# Altium schematic sheet 2) LPC1850_ P5-PA.SchDoc
size 420 x 297 mm
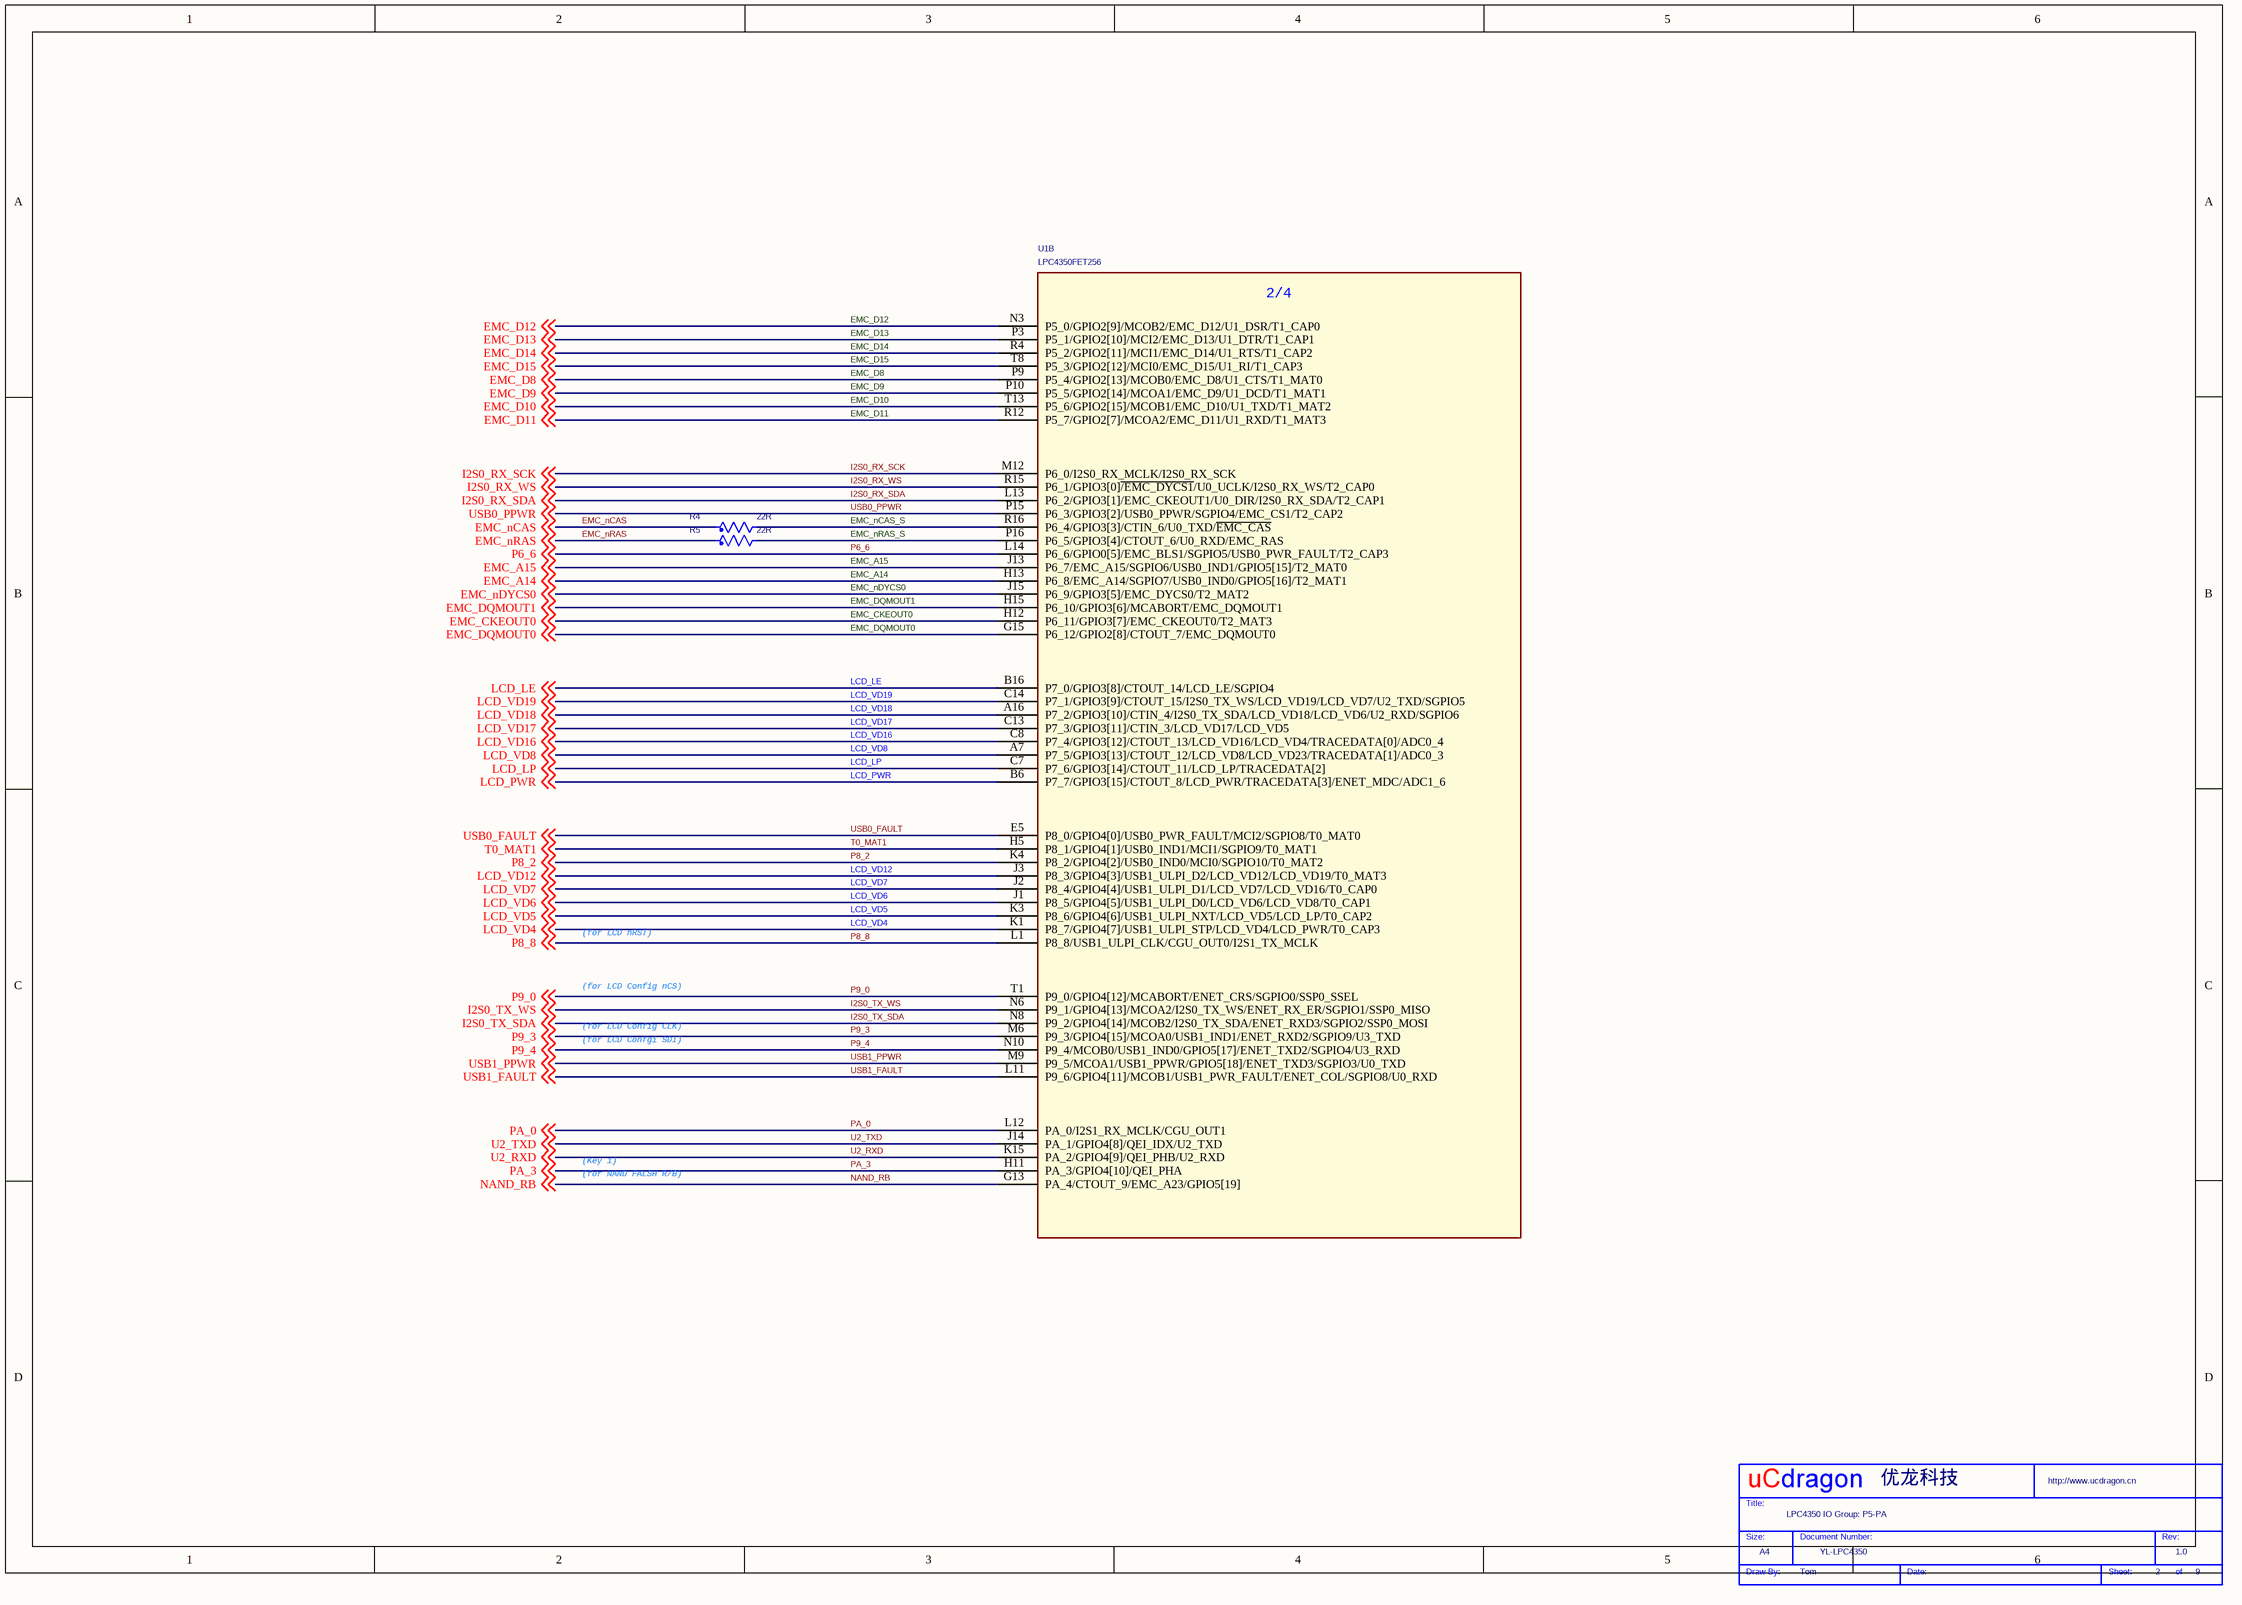
[diagram p0: 2) LPC1850_ P5-PA.SchDoc]

## Parts
*  Company: 优龙科技  Drawing: Tom  Doc: YL-LPC4350  RevCode: 1.0  Title: LPC4350 IO Group: P5-PA  Page Size: A4  Page Number: 2  Page Count: 9  (hidden comment: My Title 0)  (graphical)
R4  22R  [R0603]
R5  22R  [R0603]
U1  LPC4350FET256  [LBGA256]  (part B of 4)

## Nets
EMC_A14: U1.H13(P6_8/EMC_A14/SGPIO7/USB0_IND0/GPIO5[16]/T2_MAT1) ; off-sheet EMC_A14
EMC_A15: U1.J13(P6_7/EMC_A15/SGPIO6/USB0_IND1/GPIO5[15]/T2_MAT0) ; off-sheet EMC_A15
EMC_CKEOUT0: U1.H12(P6_11/GPIO3[7]/EMC_CKEOUT0/T2_MAT3) ; off-sheet EMC_CKEOUT0
EMC_D8: U1.P9(P5_4/GPIO2[13]/MCOB0/EMC_D8/U1_CTS/T1_MAT0) ; off-sheet EMC_D8
EMC_D9: U1.P10(P5_5/GPIO2[14]/MCOA1/EMC_D9/U1_DCD/T1_MAT1) ; off-sheet EMC_D9
EMC_D10: U1.T13(P5_6/GPIO2[15]/MCOB1/EMC_D10/U1_TXD/T1_MAT2) ; off-sheet EMC_D10
EMC_D11: U1.R12(P5_7/GPIO2[7]/MCOA2/EMC_D11/U1_RXD/T1_MAT3) ; off-sheet EMC_D11
EMC_D12: U1.N3(P5_0/GPIO2[9]/MCOB2/EMC_D12/U1_DSR/T1_CAP0) ; off-sheet EMC_D12
EMC_D13: U1.P3(P5_1/GPIO2[10]/MCI2/EMC_D13/U1_DTR/T1_CAP1) ; off-sheet EMC_D13
EMC_D14: U1.R4(P5_2/GPIO2[11]/MCI1/EMC_D14/U1_RTS/T1_CAP2) ; off-sheet EMC_D14
EMC_D15: U1.T8(P5_3/GPIO2[12]/MCI0/EMC_D15/U1_RI/T1_CAP3) ; off-sheet EMC_D15
EMC_DQMOUT0: U1.G15(P6_12/GPIO2[8]/CTOUT_7/EMC_DQMOUT0) ; off-sheet EMC_DQMOUT0
EMC_DQMOUT1: U1.H15(P6_10/GPIO3[6]/MCABORT/EMC_DQMOUT1) ; off-sheet EMC_DQMOUT1
EMC_nCAS: R4.1 ; off-sheet EMC_nCAS
EMC_nCAS_S: R4.2 U1.R16(P6_4/GPIO3[3]/CTIN_6/U0_TXD/~{EMC_CAS})
EMC_nDYCS0: U1.J15(P6_9/GPIO3[5]/EMC_DYCS0/T2_MAT2) ; off-sheet EMC_nDYCS0
EMC_nRAS: R5.1 ; off-sheet EMC_nRAS
EMC_nRAS_S: R5.2 U1.P16(P6_5/GPIO3[4]/CTOUT_6/U0_RXD/EMC_RAS)
I2S0_RX_SCK: U1.M12(P6_0/I2S0_RX_MCLK/I2S0_RX_SCK) ; off-sheet I2S0_RX_SCK
I2S0_RX_SDA: U1.L13(P6_2/GPIO3[1]/EMC_CKEOUT1/U0_DIR/I2S0_RX_SDA/T2_CAP1) ; off-sheet I2S0_RX_SDA
I2S0_RX_WS: U1.R15(P6_1/GPIO3[0]~{/EMC_DYCS1}/U0_UCLK/I2S0_RX_WS/T2_CAP0) ; off-sheet I2S0_RX_WS
I2S0_TX_SDA: U1.N8(P9_2/GPIO4[14]/MCOB2/I2S0_TX_SDA/ENET_RXD3/SGPIO2/SSP0_MOSI) ; off-sheet I2S0_TX_SDA
I2S0_TX_WS: U1.N6(P9_1/GPIO4[13]/MCOA2/I2S0_TX_WS/ENET_RX_ER/SGPIO1/SSP0_MISO) ; off-sheet I2S0_TX_WS
LCD_LE: U1.B16(P7_0/GPIO3[8]/CTOUT_14/LCD_LE/SGPIO4) ; off-sheet LCD_LE
LCD_LP: U1.C7(P7_6/GPIO3[14]/CTOUT_11/LCD_LP/TRACEDATA[2]) ; off-sheet LCD_LP
LCD_PWR: U1.B6(P7_7/GPIO3[15]/CTOUT_8/LCD_PWR/TRACEDATA[3]/ENET_MDC/ADC1_6) ; off-sheet LCD_PWR
LCD_VD4: U1.K1(P8_7/GPIO4[7]/USB1_ULPI_STP/LCD_VD4/LCD_PWR/T0_CAP3) ; off-sheet LCD_VD4
LCD_VD5: U1.K3(P8_6/GPIO4[6]/USB1_ULPI_NXT/LCD_VD5/LCD_LP/T0_CAP2) ; off-sheet LCD_VD5
LCD_VD6: U1.J1(P8_5/GPIO4[5]/USB1_ULPI_D0/LCD_VD6/LCD_VD8/T0_CAP1) ; off-sheet LCD_VD6
LCD_VD7: U1.J2(P8_4/GPIO4[4]/USB1_ULPI_D1/LCD_VD7/LCD_VD16/T0_CAP0) ; off-sheet LCD_VD7
LCD_VD8: U1.A7(P7_5/GPIO3[13]/CTOUT_12/LCD_VD8/LCD_VD23/TRACEDATA[1]/ADC0_3) ; off-sheet LCD_VD8
LCD_VD12: U1.J3(P8_3/GPIO4[3]/USB1_ULPI_D2/LCD_VD12/LCD_VD19/T0_MAT3) ; off-sheet LCD_VD12
LCD_VD16: U1.C8(P7_4/GPIO3[12]/CTOUT_13/LCD_VD16/LCD_VD4/TRACEDATA[0]/ADC0_4) ; off-sheet LCD_VD16
LCD_VD17: U1.C13(P7_3/GPIO3[11]/CTIN_3/LCD_VD17/LCD_VD5) ; off-sheet LCD_VD17
LCD_VD18: U1.A16(P7_2/GPIO3[10]/CTIN_4/I2S0_TX_SDA/LCD_VD18/LCD_VD6/U2_RXD/SGPIO6) ; off-sheet LCD_VD18
LCD_VD19: U1.C14(P7_1/GPIO3[9]/CTOUT_15/I2S0_TX_WS/LCD_VD19/LCD_VD7/U2_TXD/SGPIO5) ; off-sheet LCD_VD19
NAND_RB: U1.G13(PA_4/CTOUT_9/EMC_A23/GPIO5[19]) ; off-sheet NAND_RB
P6_6: U1.L14(P6_6/GPIO0[5]/EMC_BLS1/SGPIO5/USB0_PWR_FAULT/T2_CAP3) ; off-sheet P6_6
P8_2: U1.K4(P8_2/GPIO4[2]/USB0_IND0/MCI0/SGPIO10/T0_MAT2) ; off-sheet P8_2
P8_8: U1.L1(P8_8/USB1_ULPI_CLK/CGU_OUT0/I2S1_TX_MCLK) ; off-sheet P8_8
P9_0: U1.T1(P9_0/GPIO4[12]/MCABORT/ENET_CRS/SGPIO0/SSP0_SSEL) ; off-sheet P9_0
P9_3: U1.M6(P9_3/GPIO4[15]/MCOA0/USB1_IND1/ENET_RXD2/SGPIO9/U3_TXD) ; off-sheet P9_3
P9_4: U1.N10(P9_4/MCOB0/USB1_IND0/GPIO5[17]/ENET_TXD2/SGPIO4/U3_RXD) ; off-sheet P9_4
PA_0: U1.L12(PA_0/I2S1_RX_MCLK/CGU_OUT1) ; off-sheet PA_0
PA_3: U1.H11(PA_3/GPIO4[10]/QEI_PHA) ; off-sheet PA_3
T0_MAT1: U1.H5(P8_1/GPIO4[1]/USB0_IND1/MCI1/SGPIO9/T0_MAT1) ; off-sheet T0_MAT1
U2_RXD: U1.K15(PA_2/GPIO4[9]/QEI_PHB/U2_RXD) ; off-sheet U2_RXD
U2_TXD: U1.J14(PA_1/GPIO4[8]/QEI_IDX/U2_TXD) ; off-sheet U2_TXD
USB0_FAULT: U1.E5(P8_0/GPIO4[0]/USB0_PWR_FAULT/MCI2/SGPIO8/T0_MAT0) ; off-sheet USB0_FAULT
USB0_PPWR: U1.P15(P6_3/GPIO3[2]/USB0_PPWR/SGPIO4/EMC_CS1/T2_CAP2) ; off-sheet USB0_PPWR
USB1_FAULT: U1.L11(P9_6/GPIO4[11]/MCOB1/USB1_PWR_FAULT/ENET_COL/SGPIO8/U0_RXD) ; off-sheet USB1_FAULT
USB1_PPWR: U1.M9(P9_5/MCOA1/USB1_PPWR/GPIO5[18]/ENET_TXD3/SGPIO3/U0_TXD) ; off-sheet USB1_PPWR

## Notes on the sheet
- (for LCD nRST)
- (for LCD Config nCS)
- (for LCD Config CLK)
- (for LCD Confgi SDI)
- (Key 1)
- (for NAND FALSH R/B)
- (in symbol LPC4350FET256, part B) 2/4
- (in symbol My Title 0) Title:; Size:; Document Number:; Rev:; Draw By:; Date:; Sheet:; of

## Library data of the parts
R4 R5 = R_Generic_Dup2
* = My Title 0: WebSite: http://www.ucdragon.cn; Page Create Date: May 29, 2006